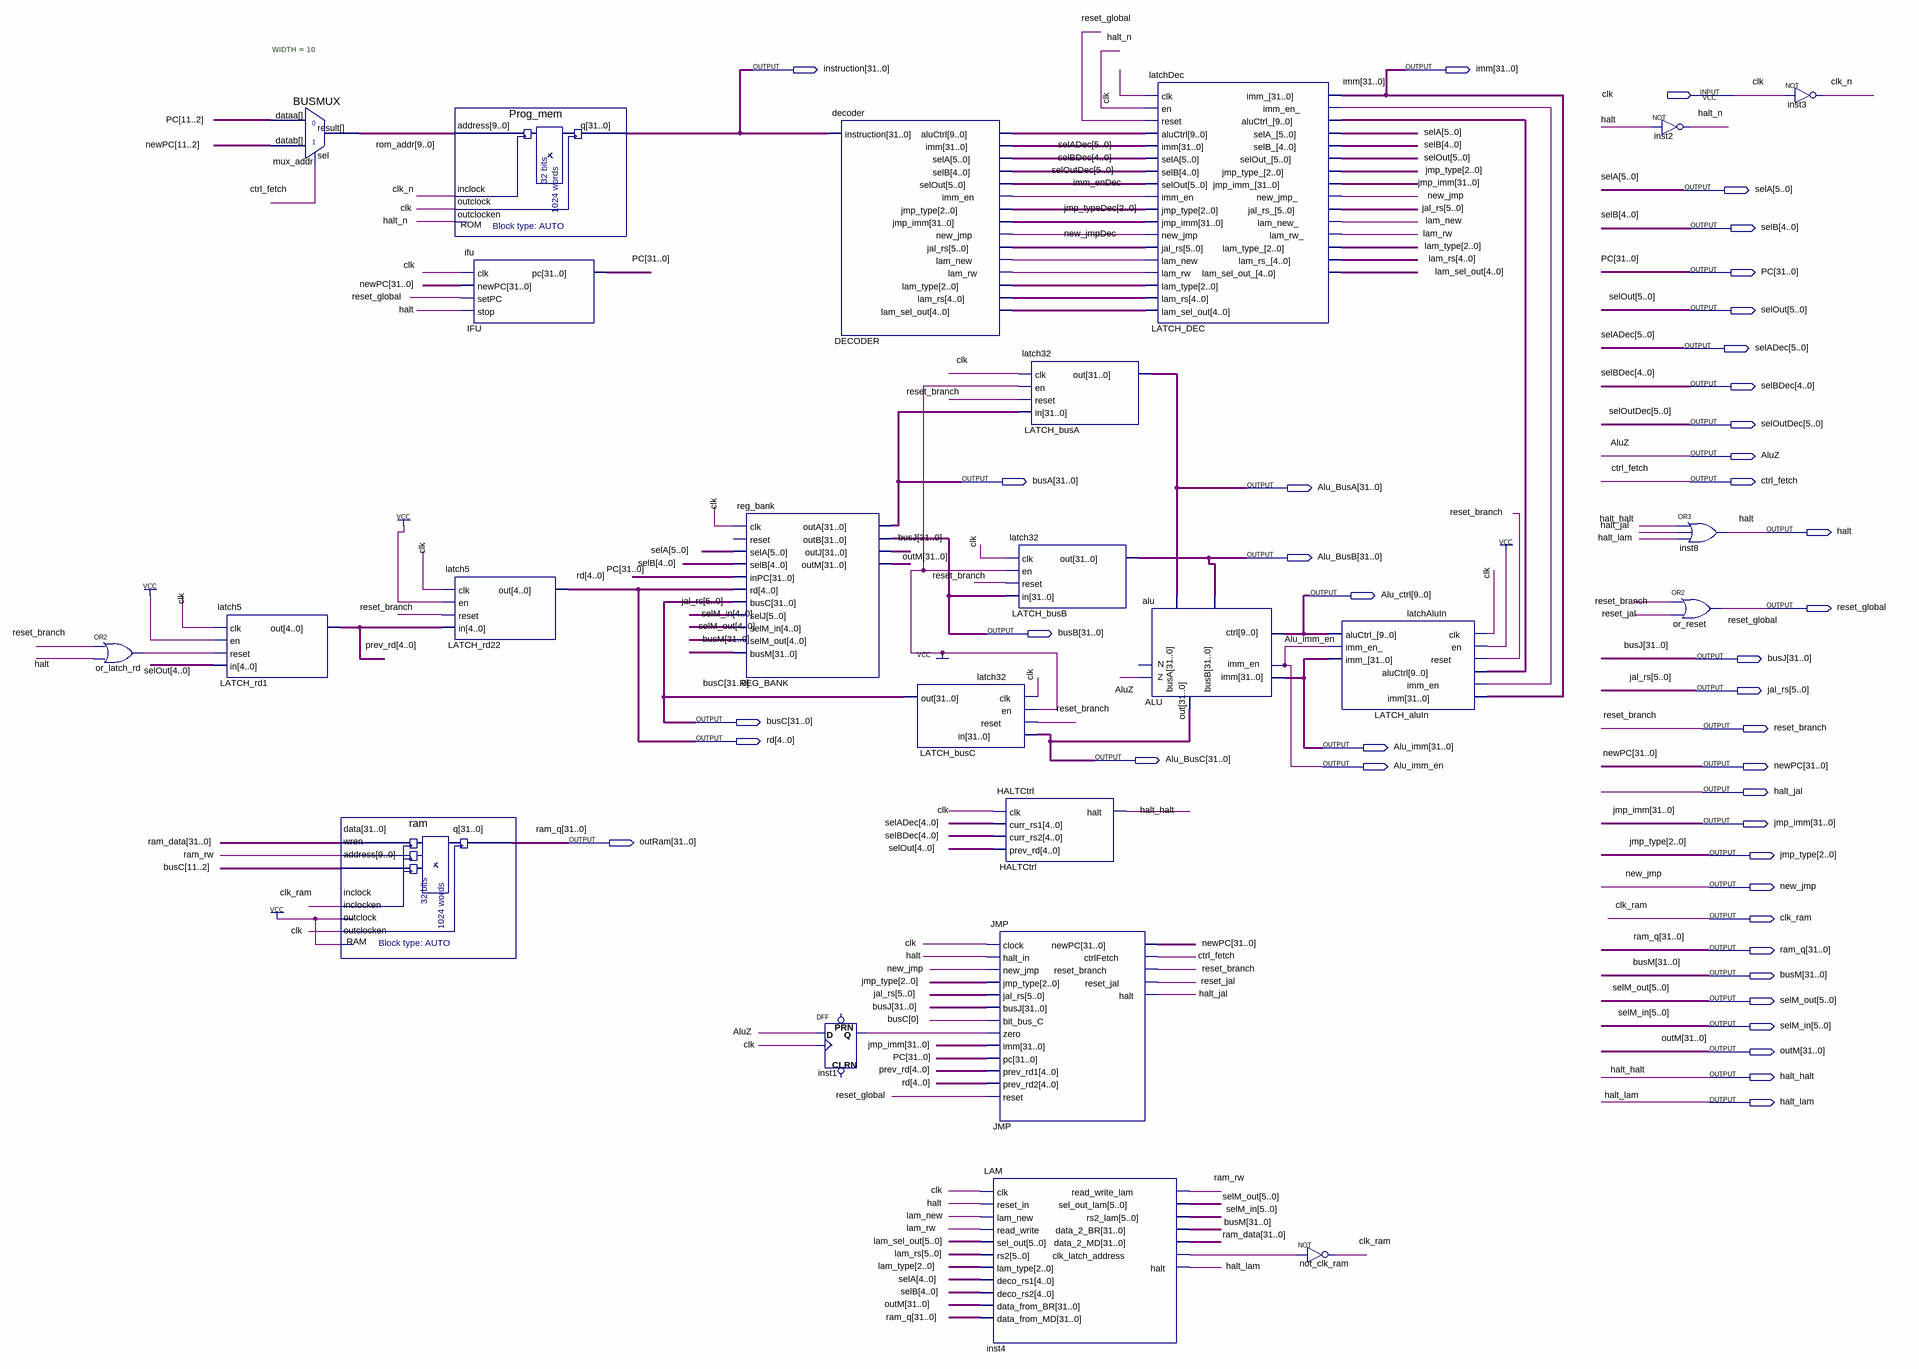
[diagram p0: schematic sheet]
// Quartus schematic TP2.bdf as structural Verilog: 24 symbols, 41 pins
module TP2 (
  input  clk,
  output [31:0] instruction,
  output [31:0] imm,
  output [5:0] selA,
  output [4:0] selB,
  output [31:0] PC,
  output [5:0] selOut,
  output [5:0] selADec,
  output [4:0] selBDec,
  output [5:0] selOutDec,
  output AluZ,
  output [31:0] busA,
  output ctrl_fetch,
  output [31:0] Alu_BusA,
  output halt,
  output [31:0] Alu_BusB,
  output [9:0] Alu_ctrl,
  output reset_global,
  output [31:0] busB,
  output [31:0] busJ,
  output [5:0] jal_rs,
  output [31:0] busC,
  output reset_branch,
  output [4:0] rd,
  output [31:0] Alu_imm,
  output [31:0] Alu_BusC,
  output Alu_imm_en,
  output [31:0] newPC,
  output halt_jal,
  output [31:0] jmp_imm,
  output [31:0] outRam,
  output [2:0] jmp_type,
  output new_jmp,
  output clk_ram,
  output [31:0] ram_q,
  output [31:0] busM,
  output [5:0] selM_out,
  output [5:0] selM_in,
  output [31:0] outM,
  output halt_halt,
  output halt_lam
);

  wire clk_n, DECODER_lam_new, DECODER_lam_rw, halt_n, imm_enDec, inst1_q, inst4_clk_latch_address, lam_new,
       lam_rw, LATCH_DEC_imm_en_, new_jmpDec, or_latch_rd_out, ram_rw, reset_jal;
  wire [2:0] DECODER_lam_type, jmp_typeDec, lam_type;
  wire [4:0] DECODER_lam_rs, DECODER_lam_sel_out, prev_rd;
  wire [5:0] DECODER_jal_rs, lam_rs, lam_sel_out;
  wire [9:0] DECODER_aluctrl, LATCH_DEC_aluctrl_, rom_addr;
  wire [31:0] DECODER_imm, DECODER_jmp_imm, ram_data;

  or or_latch_rd (or_latch_rd_out, reset_branch, halt);
  latch5 LATCH_rd1 (.clk(clk), .en(1'b1), .reset(or_latch_rd_out), .in(selOut[4:0]), .out(prev_rd));
  BUSMUX #(.WIDTH(10)) mux_addr (.datab(newPC[11:2]), .sel(ctrl_fetch), .dataa(PC[11:2]), .result(rom_addr));
  ram RAM (
    .data(ram_data), .wren(ram_rw), .address(busC[11:2]), .inclock(clk_ram), .inclocken(1'b1),
    .outclock(clk), .outclocken(1'b1), .q(outRam));
  Prog_mem ROM (.address(rom_addr), .inclock(clk_n), .outclock(clk), .outclocken(halt_n), .q(instruction));
  ifu IFU (.clk(clk), .newPC(newPC), .setPC(reset_global), .stop(halt), .pc(PC));
  latch5 LATCH_rd22 (.clk(clk), .en(1'b1), .reset(reset_branch), .in(prev_rd), .out(rd));
  reg_bank REG_BANK (
    .clk(clk), .selA(selA), .selB(selB), .inPC(PC), .rd(rd), .busC(busC), .selJ(jal_rs),
    .selM_in(selM_in[4:0]), .selM_out(selM_out[4:0]), .busM(busM), .outA(busA), .outB(busB), .outJ(busJ),
    .outM(outM));  // open: reset
  decoder DECODER (
    .instruction(instruction), .aluCtrl(DECODER_aluctrl), .imm(DECODER_imm), .selA(selADec), .selB(selBDec),
    .selOut(selOutDec), .imm_en(imm_enDec), .jmp_type(jmp_typeDec), .jmp_imm(DECODER_jmp_imm),
    .new_jmp(new_jmpDec), .jal_rs(DECODER_jal_rs), .lam_new(DECODER_lam_new), .lam_rw(DECODER_lam_rw),
    .lam_type(DECODER_lam_type), .lam_rs(DECODER_lam_rs), .lam_sel_out(DECODER_lam_sel_out));
  DFF inst1 (.CLK(clk), .D(AluZ), .Q(inst1_q));  // open: CLRN, PRN
  latch32 LATCH_busC (.clk(clk), .en(1'b1), .reset(reset_branch), .in(Alu_BusC), .out(busC));
  HALTCtrl HALTCtrl (.clk(clk), .curr_rs1(selADec[4:0]), .curr_rs2(selBDec), .prev_rd(selOut[4:0]), .halt(halt_halt));
  JMP JMP (
    .clock(clk), .halt_in(halt), .new_jmp(new_jmp), .jmp_type(jmp_type), .jal_rs(jal_rs), .busJ(busJ),
    .bit_bus_C(busC[0]), .zero(inst1_q), .imm(jmp_imm), .pc(PC), .prev_rd1(prev_rd), .prev_rd2(rd),
    .reset(reset_global), .newPC(newPC), .ctrlFetch(ctrl_fetch), .reset_branch(reset_branch),
    .reset_jal(reset_jal), .halt(halt_jal));
  LAM inst4 (
    .clk(clk), .reset_in(halt), .lam_new(lam_new), .read_write(lam_rw), .sel_out(lam_sel_out), .rs2(lam_rs),
    .lam_type(lam_type), .deco_rs1(selA[4:0]), .deco_rs2(selB), .data_from_BR(outM), .data_from_MD(outRam),
    .read_write_lam(ram_rw), .sel_out_lam(selM_out), .rs2_lam(selM_in), .data_2_BR(busM),
    .data_2_MD(ram_data), .clk_latch_address(inst4_clk_latch_address), .halt(halt_lam));
  latch32 LATCH_busA (.clk(clk), .en(1'b1), .reset(reset_branch), .in(busA), .out(Alu_BusA));
  latch32 LATCH_busB (.clk(clk), .en(1'b1), .reset(reset_branch), .in(busB), .out(Alu_BusB));
  latchDec LATCH_DEC (
    .clk(clk), .en(halt_n), .reset(reset_global), .aluCtrl(DECODER_aluctrl), .imm(DECODER_imm),
    .selA(selADec), .selB(selBDec), .selOut(selOutDec), .imm_en(imm_enDec), .jmp_type(jmp_typeDec),
    .jmp_imm(DECODER_jmp_imm), .new_jmp(new_jmpDec), .jal_rs(DECODER_jal_rs), .lam_new(DECODER_lam_new),
    .lam_rw(DECODER_lam_rw), .lam_type(DECODER_lam_type), .lam_rs(DECODER_lam_rs),
    .lam_sel_out(DECODER_lam_sel_out), .imm_(imm), .imm_en_(LATCH_DEC_imm_en_),
    .aluCtrl_(LATCH_DEC_aluctrl_), .selA_(selA), .selB_(selB), .selOut_(selOut), .jmp_type_(jmp_type),
    .jmp_imm_(jmp_imm), .new_jmp_(new_jmp), .jal_rs_(jal_rs), .lam_new_(lam_new), .lam_rw_(lam_rw),
    .lam_type_(lam_type), .lam_rs_(lam_rs[4:0]), .lam_sel_out_(lam_sel_out[4:0]));
  alu ALU (
    .busA(Alu_BusA), .busB(Alu_BusB), .imm(Alu_imm), .imm_en(Alu_imm_en), .ctrl(Alu_ctrl), .out(Alu_BusC),
    .Z(AluZ));  // open: N
  not not_clk_ram (clk_ram, inst4_clk_latch_address);
  latchAluIn LATCH_aluIn (
    .clk(clk), .en(1'b1), .reset(reset_branch), .aluCtrl(LATCH_DEC_aluctrl_), .imm_en(LATCH_DEC_imm_en_),
    .imm(imm), .aluCtrl_(Alu_ctrl), .imm_en_(Alu_imm_en), .imm_(Alu_imm));
  not inst2 (halt_n, halt);
  or inst8 (halt, halt_halt, halt_jal, halt_lam);
  or or_reset (reset_global, reset_branch, reset_jal);
  not inst3 (clk_n, clk);

  assign ram_q = outRam;
endmodule
